# Altium schematic sheet Slideshow.SchDoc
size A; DocumentNumber: 1; SheetNumber: 1; SheetTotal: 1
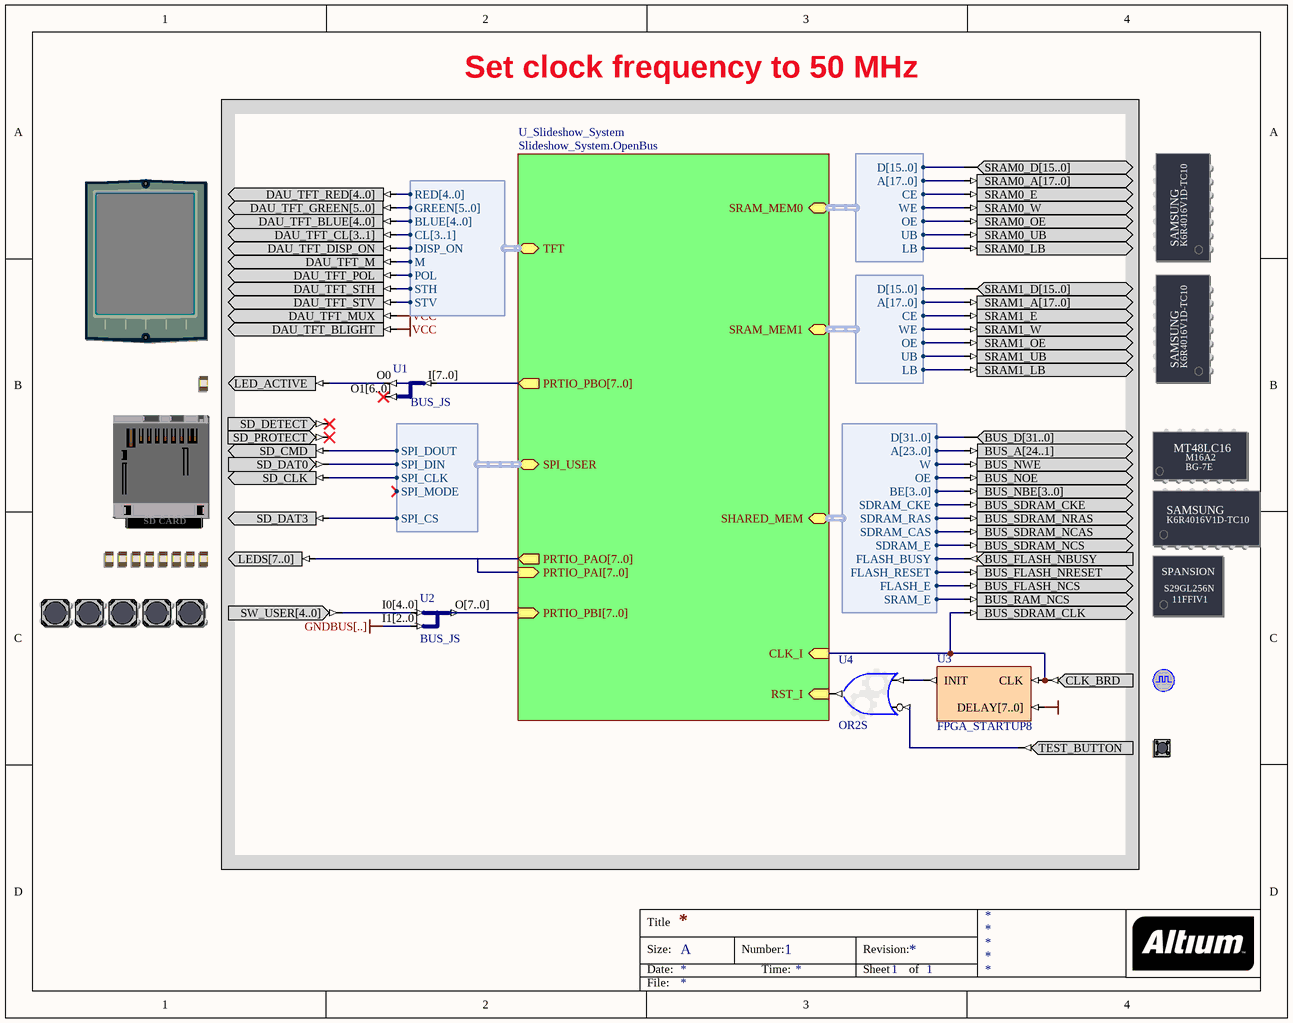
[diagram p0: Slideshow.SchDoc]

## Parts
(Parts that share a designator on the sheet are numbered #1, #2 ... from top to bottom, then left to right.)
?#1  SRAM_DAUGHTER0  (value not drawn)
?#2  TFT_LCD  (value not drawn)
?#3  SRAM_DAUGHTER1  (value not drawn)
?#4  LED_ACTIVE  (value not drawn)
?#5  SD_CARD  (value not drawn)
?#6  SHARED_MEM_DAUGHTER  (value not drawn)
?#7  LED  (value not drawn)
?#8  USER_BUTTONS  (value not drawn)
?#9  CLOCK_BOARD  (value not drawn)
?#10  TEST_BUTTON  (value not drawn)
U1  BUS_JS
U2  BUS_JS
U3  FPGA_STARTUP8
U4  OR2S

## Blocks framed on the sheet
Set clock frequency to 50 MHz: ?#1-?#10 U1-U4

## Sub-sheets
U_Slideshow_System = Slideshow_System.OpenBus: CLK_I (in), RST_I (in), PRTIO_PAO[7..0] (out), PRTIO_PAI[7..0] (in), PRTIO_PBO[7..0] (out), PRTIO_PBI[7..0] (in), SRAM_MEM0 (harness WB_MEM_CTRL_SRAM16_A18), SRAM_MEM1 (harness WB_MEM_CTRL_SRAM16_A18), SHARED_MEM (harness WB_SHARED_MEM_CTRL), TFT (harness VGA32_TFT), SPI_USER (harness SPI_W_NB)

## Harnesses
WB_MEM_CTRL_SRAM16_A18: D[15..0], A[17..0], CE, WE, OE, UB, LB
WB_SHARED_MEM_CTRL: D[31..0], A[23..0], W, OE, BE[3..0], SDRAM_CKE, SDRAM_RAS, SDRAM_CAS, SDRAM_E, FLASH_BUSY, FLASH_RESET, FLASH_E, SRAM_E
VGA32_TFT: RED[4..0], GREEN[5..0], BLUE[4..0], CL[3..1], DISP_ON, M, POL, STH, STV
SPI_W_NB: SPI_DOUT, SPI_DIN, SPI_CLK, SPI_MODE, SPI_CS

## Nets
GNDBUS[..]: U2.I1[2..0]
VCC: ?#2.DAU_TFT_BLIGHT ?#2.DAU_TFT_MUX
VCCBUS[..]: U3.DELAY[7..0]
Net?#1_SRAM0_A[17..0]: ?#1.SRAM0_A[17..0] ; sheet U_Slideshow_System/SRAM_MEM0.A[17..0]
Net?#1_SRAM0_D[15..0]: ?#1.SRAM0_D[15..0] ; sheet U_Slideshow_System/SRAM_MEM0.D[15..0]
Net?#1_SRAM0_E: ?#1.SRAM0_E ; sheet U_Slideshow_System/SRAM_MEM0.CE
Net?#1_SRAM0_LB: ?#1.SRAM0_LB ; sheet U_Slideshow_System/SRAM_MEM0.LB
Net?#1_SRAM0_OE: ?#1.SRAM0_OE ; sheet U_Slideshow_System/SRAM_MEM0.OE
Net?#1_SRAM0_UB: ?#1.SRAM0_UB ; sheet U_Slideshow_System/SRAM_MEM0.UB
Net?#1_SRAM0_W: ?#1.SRAM0_W ; sheet U_Slideshow_System/SRAM_MEM0.WE
Net?#2_DAU_TFT_BLUE[4..0]: ?#2.DAU_TFT_BLUE[4..0] ; sheet U_Slideshow_System/TFT.BLUE[4..0]
Net?#2_DAU_TFT_CL[3..1]: ?#2.DAU_TFT_CL[3..1] ; sheet U_Slideshow_System/TFT.CL[3..1]
Net?#2_DAU_TFT_DISP_ON: ?#2.DAU_TFT_DISP_ON ; sheet U_Slideshow_System/TFT.DISP_ON
Net?#2_DAU_TFT_GREEN[5..0]: ?#2.DAU_TFT_GREEN[5..0] ; sheet U_Slideshow_System/TFT.GREEN[5..0]
Net?#2_DAU_TFT_M: ?#2.DAU_TFT_M ; sheet U_Slideshow_System/TFT.M
Net?#2_DAU_TFT_POL: ?#2.DAU_TFT_POL ; sheet U_Slideshow_System/TFT.POL
Net?#2_DAU_TFT_RED[4..0]: ?#2.DAU_TFT_RED[4..0] ; sheet U_Slideshow_System/TFT.RED[4..0]
Net?#2_DAU_TFT_STH: ?#2.DAU_TFT_STH ; sheet U_Slideshow_System/TFT.STH
Net?#2_DAU_TFT_STV: ?#2.DAU_TFT_STV ; sheet U_Slideshow_System/TFT.STV
Net?#3_SRAM1_A[17..0]: ?#3.SRAM1_A[17..0] ; sheet U_Slideshow_System/SRAM_MEM1.A[17..0]
Net?#3_SRAM1_D[15..0]: ?#3.SRAM1_D[15..0] ; sheet U_Slideshow_System/SRAM_MEM1.D[15..0]
Net?#3_SRAM1_E: ?#3.SRAM1_E ; sheet U_Slideshow_System/SRAM_MEM1.CE
Net?#3_SRAM1_LB: ?#3.SRAM1_LB ; sheet U_Slideshow_System/SRAM_MEM1.LB
Net?#3_SRAM1_OE: ?#3.SRAM1_OE ; sheet U_Slideshow_System/SRAM_MEM1.OE
Net?#3_SRAM1_UB: ?#3.SRAM1_UB ; sheet U_Slideshow_System/SRAM_MEM1.UB
Net?#3_SRAM1_W: ?#3.SRAM1_W ; sheet U_Slideshow_System/SRAM_MEM1.WE
Net?#4_LED_ACTIVE: ?#4.LED_ACTIVE U1.O0
Net?#5_SD_CLK: ?#5.SD_CLK ; sheet U_Slideshow_System/SPI_USER.SPI_CLK
Net?#5_SD_CMD: ?#5.SD_CMD ; sheet U_Slideshow_System/SPI_USER.SPI_DOUT
Net?#5_SD_DAT0: ?#5.SD_DAT0 ; sheet U_Slideshow_System/SPI_USER.SPI_DIN
Net?#5_SD_DAT3: ?#5.SD_DAT3 ; sheet U_Slideshow_System/SPI_USER.SPI_CS
Net?#6_BUS_A[24..1]: ?#6.BUS_A[24..1] ; sheet U_Slideshow_System/SHARED_MEM.A[23..0]
Net?#6_BUS_D[31..0]: ?#6.BUS_D[31..0] ; sheet U_Slideshow_System/SHARED_MEM.D[31..0]
Net?#6_BUS_FLASH_NBUSY: ?#6.BUS_FLASH_NBUSY ; sheet U_Slideshow_System/SHARED_MEM.FLASH_BUSY
Net?#6_BUS_FLASH_NCS: ?#6.BUS_FLASH_NCS ; sheet U_Slideshow_System/SHARED_MEM.FLASH_E
Net?#6_BUS_FLASH_NRESET: ?#6.BUS_FLASH_NRESET ; sheet U_Slideshow_System/SHARED_MEM.FLASH_RESET
Net?#6_BUS_NBE[3..0]: ?#6.BUS_NBE[3..0] ; sheet U_Slideshow_System/SHARED_MEM.BE[3..0]
Net?#6_BUS_NOE: ?#6.BUS_NOE ; sheet U_Slideshow_System/SHARED_MEM.OE
Net?#6_BUS_NWE: ?#6.BUS_NWE ; sheet U_Slideshow_System/SHARED_MEM.W
Net?#6_BUS_RAM_NCS: ?#6.BUS_RAM_NCS ; sheet U_Slideshow_System/SHARED_MEM.SRAM_E
Net?#6_BUS_SDRAM_CKE: ?#6.BUS_SDRAM_CKE ; sheet U_Slideshow_System/SHARED_MEM.SDRAM_CKE
Net?#6_BUS_SDRAM_CLK: ?#6.BUS_SDRAM_CLK ?#9.CLK_BRD U3.CLK ; sheet U_Slideshow_System/CLK_I
Net?#6_BUS_SDRAM_NCAS: ?#6.BUS_SDRAM_NCAS ; sheet U_Slideshow_System/SHARED_MEM.SDRAM_CAS
Net?#6_BUS_SDRAM_NCS: ?#6.BUS_SDRAM_NCS ; sheet U_Slideshow_System/SHARED_MEM.SDRAM_E
Net?#6_BUS_SDRAM_NRAS: ?#6.BUS_SDRAM_NRAS ; sheet U_Slideshow_System/SHARED_MEM.SDRAM_RAS
Net?#7_LEDS[7..0]: ?#7.LEDS[7..0] ; sheet U_Slideshow_System/PRTIO_PAO[7..0], sheet U_Slideshow_System/PRTIO_PAI[7..0]
Net?#8_SW_USER[4..0]: ?#8.SW_USER[4..0] U2.I0[4..0]
Net?#10_TEST_BUTTON: ?#10.TEST_BUTTON U4.I1
NetU1_I[7..0]: U1.I[7..0] ; sheet U_Slideshow_System/PRTIO_PBO[7..0]
NetU2_O[7..0]: U2.O[7..0] ; sheet U_Slideshow_System/PRTIO_PBI[7..0]
NetU3_INIT: U3.INIT U4.I0
NetU4_O: U4.O ; sheet U_Slideshow_System/RST_I

Not connected (* = marked no-connect by the designer): ?#5 SD_DETECT* SD_PROTECT*; U1 O1[6..0]*

## Buses and harness runs
bus sheet U_Slideshow_System/PRTIO_PAI[7..0] = sheet U_Slideshow_System/PRTIO_PAO[7..0]

## Notes on the sheet
- Title
- Size:
- Date:
- A
- Number:
- Time:
- Revision:
- Sheet
- of
- File:
- (in symbol SD_CARD) SD CARD
- (in symbol SHARED_MEM_DAUGHTER) MT48LC16; M16A2; BG-7E; SAMSUNG; K6R4016V1D-TC10; SPANSION; S29GL256N; 11FFIV1
- (in symbol SRAM_DAUGHTER0) SAMSUNG; K6R4016V1D-TC10
- (in symbol SRAM_DAUGHTER1) SAMSUNG; K6R4016V1D-TC10

## Library data of the parts
?#1 = SRAM_DAUGHTER0: Free Static RAM - Daughterboard; PortComponent: True; Published: 14-May-2007; Publisher: Altium Limited; HelpURL: TR0143 NanoBoard Technical Reference Manual - NB2.pdf#page=24
?#2 = TFT_LCD: TFT LCD Panel; PortComponent: True; Published: 22-Jan-2007; Publisher: Altium Limited; HelpURL: TR0143 Technical Reference Manual for Altium's Desktop NanoBoard NB2DSK01.pdf#page=50
?#3 = SRAM_DAUGHTER1: Free Static RAM - Daughterboard; PortComponent: True; Published: 14-May-2007; Publisher: Altium Limited; HelpURL: TR0143 NanoBoard Technical Reference Manual - NB2.pdf#page=24
?#4 = LED_ACTIVE: LED; PortComponent: True; Published: 14-May-2007; Publisher: Altium Limited; HelpURL: TR0146 Technical Reference for Altium's Mass Storage Peripheral Board PB02.pdf#page=9
?#5 = SD_CARD: Secure Digital Card Socket; PortComponent: True; Published: 22-Jan-2007; Publisher: Altium Limited; UseInDSF: True; HelpURL: TR0146 Technical Reference for Altium's Mass Storage Peripheral Board PB02.pdf#page=7
?#6 = SHARED_MEM_DAUGHTER: Shared Memory - Daughterboard; PortComponent: True; Published: 14-May-2007; Publisher: Altium Limited; HelpURL: TR0149 Technical Reference for Altium's Xilinx Spartan-3 Daughter Board DB30.pdf#page=15
?#7 = LED: Bank of eight Red LEDs; PortComponent: True; Published: 19-Nov-2003; Publisher: Altium Limited; HelpURL: TR0143 NanoBoard Technical Reference Manual - NB2.pdf#page=45
?#8 = USER_BUTTONS: Generic User Buttons; PortComponent: True; Published: 16-Apr-2007; Publisher: Altium Limited; HelpURL: TR0143 Technical Reference Manual for Altium's Desktop NanoBoard NB2DSK01.pdf#page=53
?#9 = CLOCK_BOARD: Global System Clock Supply; PortComponent: True; Published: 19-Nov-2003; Publisher: Altium Limited; HelpURL: TR0143 NanoBoard Technical Reference Manual - NB2.pdf#page=36
?#10 = TEST_BUTTON: Test / Reset Button; PortComponent: True; Published: 19-Nov-2003; Publisher: Altium Limited; HelpURL: TR0143 NanoBoard Technical Reference Manual - NB2.pdf#page=47
U1 = BUS_JS: Configurable Bus Joiner/Splitter; ConfiguratorName: GENERIC_BUS_JS; ConfigurationParameters: {}Version[1.0]{}SplitterJoinerType[Splitter]{}SignalCount[2]{}SignalWidth0[1]{}SignalWidth1[7]{}; LastRevisionNo: 1.00.00; Published: 17-Sep-2008; Publisher: Altium Limited
U2 = BUS_JS: Configurable Bus Joiner/Splitter; ConfiguratorName: GENERIC_BUS_JS; ConfigurationParameters: {}Version[1.0]{}SplitterJoinerType[Joiner]{}SignalCount[2]{}SignalWidth0[5]{}SignalWidth1[3]{}; LastRevisionNo: 1.00.00; Published: 17-Sep-2008; Publisher: Altium Limited
U3 = FPGA_STARTUP8: FPGA Startup With 8 Bit Delay; Published: 9-Dec-2004; Publisher: Altium Limited; HelpURL: CR0119 FPGA_STARTUPx Powerup Delay Unit.pdf; LastRevisionNo: 1.00.00; ComponentLink1Description: Core &Resource Usage; ComponentLink1URL: CR0139 FPGA Peripheral Resource Usage.pdf#page=10
U4 = GATE: Configurable Generic Gate; ConfiguratorName: GENERIC_GATE; ConfigurationParameters: {}Version[1.0]{}GateKind[OR]{}BusInput[False]{}GateInputType[Bit]{}GateOutputOption[Normal]{}BusWidth[8]{}RegisterOutputs[False]{}NegativeClockEdge[False]{}InputCount[2]{}InputInvert0[False]{}InputInvert1[True]{}; LastRevisionNo: 1.00.00; Published: 3-Sep-2008; Publisher: Altium Limited